# Altium schematic sheet Q12.SchDoc
size A3
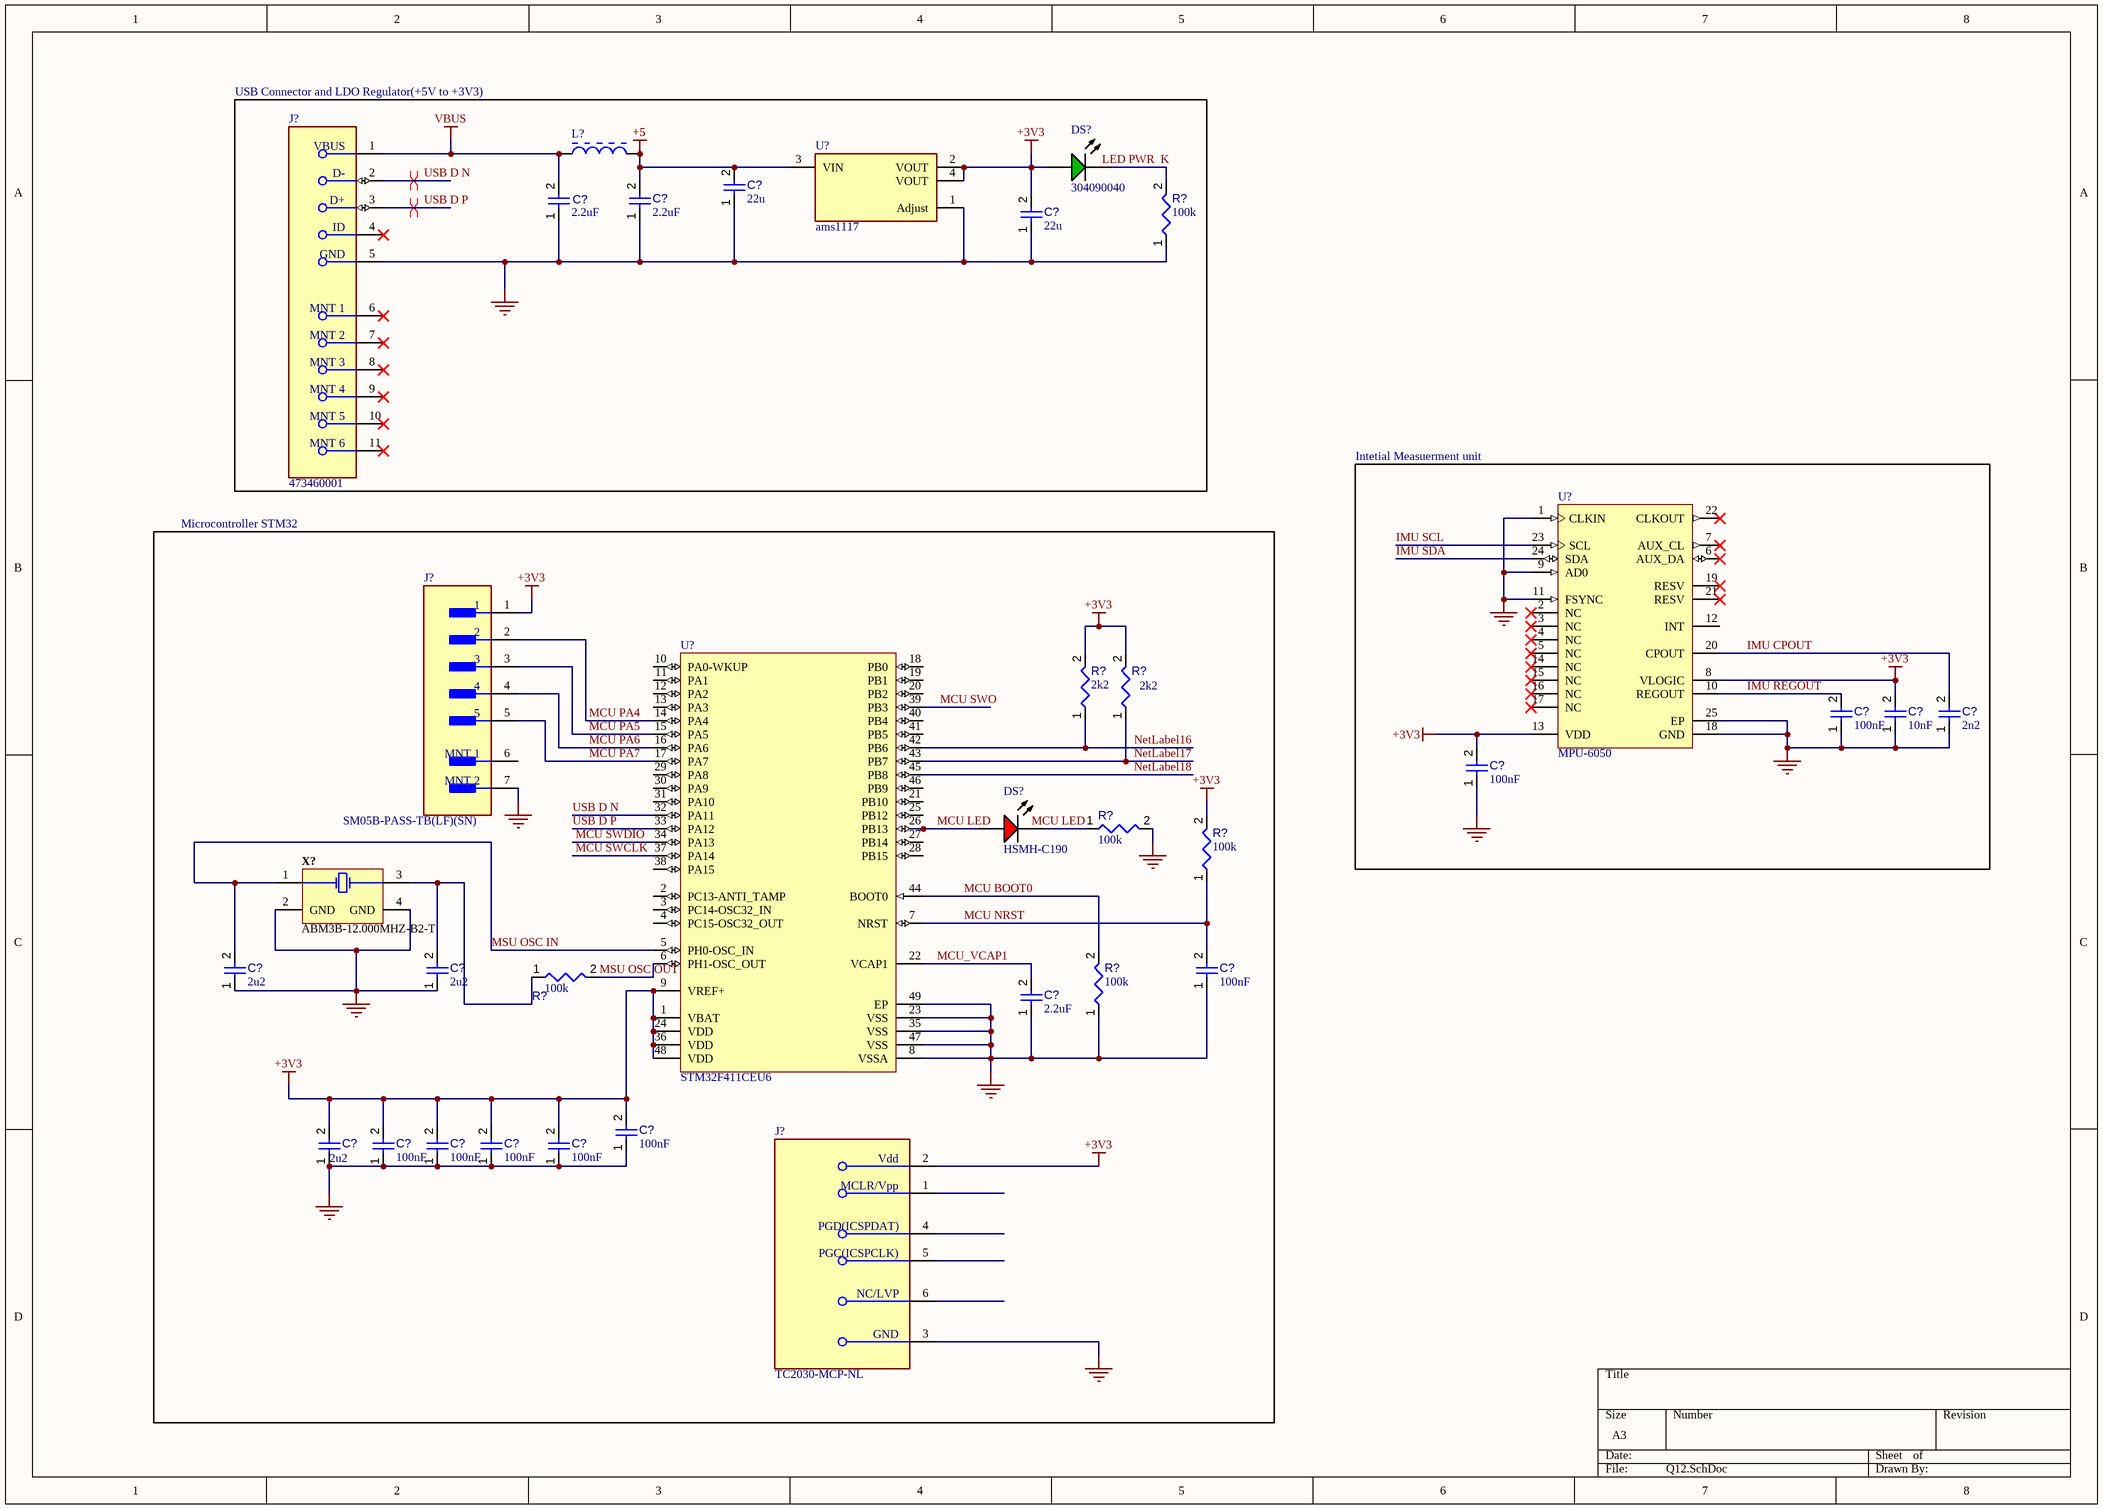
[diagram p0: Q12.SchDoc]

## Parts
(Parts that share a designator on the sheet are numbered #1, #2 ... from top to bottom, then left to right.)
C?#1  value 22u  [CAPC0805(2012)145_L]  (hidden comment: Capacitor 47µF +/-40% 6.3V 0805)
C?#2  value 2.2uF  [CAPC0603(1608)100_L]  (hidden comment: Capacitor 1µF +/-0.1% 25V 0603)
C?#3  value 2.2uF  [CAPC0603(1608)100_L]  (hidden comment: Capacitor 1µF +/-0.1% 25V 0603)
C?#4  value 22u  [CAPC0805(2012)145_L]  (hidden comment: Capacitor 47µF +/-40% 6.3V 0805)
C?#5  value 100nF  [CAPC0402(1005)60_L]  (hidden comment: Capacitor 100nF +/-20% 25V 0402)
C?#6  value 10nF  [CAPC0402(1005)60_L]  (hidden comment: Capacitor 100nF +/-20% 25V 0402)
C?#7  value 2n2  [CAPC0402(1005)60_L]  (hidden comment: Capacitor 100nF +/-20% 25V 0402)
C?#8  value 100nF  [CAPC0402(1005)60_L]  (hidden comment: Capacitor 100nF +/-20% 25V 0402)
C?#9  value 2u2  [CAPC0603(1608)100_L]  (hidden comment: Capacitor 1µF +/-0.1% 25V 0603)
C?#10  value 2u2  [CAPC0603(1608)100_L]  (hidden comment: Capacitor 1µF +/-0.1% 25V 0603)
C?#11  value 100nF  [CAPC0402(1005)60_L]  (hidden comment: Capacitor 100nF +/-20% 25V 0402)
C?#12  value 2.2uF  [CAPC0603(1608)100_L]  (hidden comment: Capacitor 1µF +/-0.1% 25V 0603)
C?#13  value 100nF  [CAPC0402(1005)60_L]  (hidden comment: Capacitor 100nF +/-20% 25V 0402)
C?#14  value 2u2  [CAPC0603(1608)100_L]  (hidden comment: Capacitor 1µF +/-0.1% 25V 0603)
C?#15  value 100nF  [CAPC0402(1005)60_L]  (hidden comment: Capacitor 100nF +/-20% 25V 0402)
C?#16  value 100nF  [CAPC0402(1005)60_L]  (hidden comment: Capacitor 100nF +/-20% 25V 0402)
C?#17  value 100nF  [CAPC0402(1005)60_L]  (hidden comment: Capacitor 100nF +/-20% 25V 0402)
C?#18  value 100nF  [CAPC0402(1005)60_L]  (hidden comment: Capacitor 100nF +/-20% 25V 0402)
DS?#1  304090040  [LED-2P-2.28-3MM]
DS?#2  HSMH-C190  [AVAG-HSMX-C190_V]
J?#1  473460001  [FP-473460001-MFG]
J?#2  SM05B-PASS-TB(LF)(SN)  [FP-SM05B-PASS-TB_LF_SN-MFG]
J?#3  TC2030-MCP-NL  [FP-TC2030-MCP-NL-MFG]
L?  BLM18AG121SN1D  [MURA-BLM18-F-H1-CHIP-2_V]  (value not drawn)
R?#1  value 100k  [RESC0402(1005)_L]  (hidden comment: 100KR2F)
R?#2  value 2k2  [RESC0402(1005)_L]  (hidden comment: 100KR2F)
R?#3  value 2k2  [RESC0402(1005)_L]  (hidden comment: 100KR2F)
R?#4  value 100k  [RESC0402(1005)_L]  (hidden comment: 100KR2F)
R?#5  value 100k  [RESC0402(1005)_L]  (hidden comment: 100KR2F)
R?#6  value 100k  [RESC0402(1005)_L]  (hidden comment: 100KR2F)
R?#7  value 100k  [RESC0402(1005)_L]  (hidden comment: 100KR2F)
U?#1  ams1117  [FP-ams1117-IPC_C]
U?#2  MPU-6050  [IS-QFN-24_V]
U?#3  STM32F411CEU6  [STM-UFQFPN48_L]
X?  ABM3B-12.000MHZ-B2-T  [ABRA-ABM3B-4_V]

## Blocks framed on the sheet
USB Connector and LDO Regulator(+5V to +3V3): C?#1-C?#4 DS?#1 J?#1 L? R?#1 U?#1
Intetial Measuerment unit: C?#5-C?#8 U?#2
Microcontroller STM32: C?#9-C?#18 DS?#2 J?#2 J?#3 R?#2-R?#7 U?#3 X?

## Nets
+3V3: C?#4.2 C?#6.2 C?#8.2 C?#13.2 C?#14.2 C?#15.2 C?#16.2 C?#17.2 C?#18.2 DS?#1.1(A) J?#2.1 J?#3.2(Vdd) R?#2.2 R?#3.2 R?#5.2 U?#1.2(VOUT) U?#1.4(VOUT) U?#2.8(VLOGIC) U?#2.13(VDD) U?#3.1(VBAT) U?#3.9(VREF+) U?#3.24(VDD) U?#3.36(VDD) U?#3.48(VDD)
+5: C?#1.2 C?#3.2 L?.2 U?#1.3(VIN)
GND: C?#1.1 C?#2.1 C?#3.1 C?#4.1 C?#5.1 C?#6.1 C?#7.1 C?#8.1 C?#9.1 C?#10.1 C?#11.1 C?#12.1 C?#13.1 C?#14.1 C?#15.1 C?#16.1 C?#17.1 C?#18.1 J?#1.5(GND) J?#2.7(MNT_2) J?#3.3(GND) R?#1.1 R?#4.2 R?#7.1 U?#1.1(Adjust) U?#2.1(CLKIN) U?#2.9(AD0) U?#2.11(FSYNC) U?#2.18(GND) U?#2.25(EP) U?#3.8(VSSA) U?#3.23(VSS) U?#3.35(VSS) U?#3.47(VSS) U?#3.49(EP) X?.2(GND) X?.4(GND)
VBUS: C?#2.2 J?#1.1(VBUS) L?.1
 MCU PA4: J?#2.2 U?#3.14(PA4)
 MCU PA5: J?#2.3 U?#3.15(PA5)
 MCU PA6: J?#2.4 U?#3.16(PA6)
 MCU PA7: J?#2.5 U?#3.17(PA7)
 MCU SWCLK: U?#3.37(PA14)
 MCU SWDIO: U?#3.34(PA13)
 MCU SWO: U?#3.39(PB3)
IMU CPOUT: C?#7.2 U?#2.20(CPOUT)
IMU REGOUT: C?#5.2 U?#2.10(REGOUT)
IMU SCL: U?#2.23(SCL)
IMU SDA: U?#2.24(SDA)
MCU BOOT0: R?#7.2 U?#3.44(BOOT0)
MCU LED: DS?#2.1(A) U?#3.26(PB13)
MCU NRST: C?#11.2 R?#5.1 U?#3.7(NRST)
MCU_VCAP1: C?#12.2 U?#3.22(VCAP1)
MSU OSC IN: C?#9.2 U?#3.5(PH0-OSC_IN) X?.1(X1)
MSU OSC OUT: R?#6.2 U?#3.6(PH1-OSC_OUT)
NetLabel16: R?#2.1 U?#3.42(PB6)
NetLabel17: R?#3.1 U?#3.43(PB7)
NetLabel18: U?#3.45(PB8)
USB D N: J?#1.2(D-) U?#3.32(PA11)
USB D P: J?#1.3(D+) U?#3.33(PA12)
NetC?#10_2: C?#10.2 R?#6.1 X?.3(X2)
NetDS?#1_2: DS?#1.2(K) R?#1.2
NetDS?#2_2: DS?#2.2(K) R?#4.1

Not connected (* = marked no-connect by the designer): J?#1 4(ID)* 6(MNT_1)* 7(MNT_2)* 8(MNT_3)* 9(MNT_4)* 10(MNT_5)* 11(MNT_6)*; J?#2 6(MNT_1); J?#3 1(MCLR/Vpp) 4(PGD(ICSPDAT)) 5(PGC(ICSPCLK)) 6(NC/LVP); U?#2 2(NC)* 3(NC)* 4(NC)* 5(NC)* 6(AUX_DA)* 7(AUX_CL)* 12(INT) 14(NC)* 15(NC)* 16(NC)* 17(NC)* 19(RESV)* 21(RESV)* 22(CLKOUT)*; U?#3 2(PC13-ANTI_TAMP) 3(PC14-OSC32_IN) 4(PC15-OSC32_OUT) 10(PA0-WKUP) 11(PA1) 12(PA2) 13(PA3) 18(PB0) 19(PB1) 20(PB2) 21(PB10) 25(PB12) 27(PB14) 28(PB15) 29(PA8) 30(PA9) 31(PA10) 38(PA15) 40(PB4) 41(PB5) 46(PB9)

## Layout directives
differential pair: USB D N, USB D P

## Notes on the sheet
- Labels drawn without touching a wire or pin:  LED PWR  K, MCU LED

## Library data of the parts
C?#1 C?#4 = CMP-001-00082-4: Chip Capacitor, 47µF +/-40%, 6.3V, 0805, Thickness 1.45 mm; Tolerance: 10%; Min Operating Temperature: -55°C; Max Operating Temperature: 85°C; Case/Package: 0805; Pins: 2; Mounting Technology: SMT; Voltage Rating: 6.3V
C?#2 C?#3 C?#9 C?#10 C?#12 C?#14 = CMP-001-00055-4: Chip Capacitor, 2.2uF +/-0.1%, 25V, 0603, Thickness 1 mm; Tolerance: 20%; Min Operating Temperature: -55°C; Max Operating Temperature: 85°C; Voltage Rating: 25V; Mounting Technology: SMT; Case/Package: 0603; Pins: 2
C?#5-C?#8 C?#11 C?#13 C?#15-C?#18 = CMP-001-00065-4: Chip Capacitor, 100nF +/-20%, 25V, 0402, Thickness 0.6 mm; Tolerance: 10%; Max Operating Temperature: 85°C; Min Operating Temperature: -55°C; Pins: 2; Voltage Rating: 25V; Mounting Technology: SMT; Case/Package: 0402
DS?#1 = CMP-007-00006-2: Green LED, 80 mW, 20 mA, -25 to 85 degC, 2-Pin THD; Manufacturer: Shenzhen CGX; Manufacturer URL: http://szcgx.com/; Package Reference: 304090040; Datasheet Version: Rev. 1.0, 09/2014; RoHS Compliant: Unknown; Case/Package: 304090040; Package Description: 2-Pin Through Hole Device, Dia 3 mm, Pitch 2.28 mm; Datasheet URL: http://datasheet.octopart.com/304090040-Chengguangxing-datasheet-62330655.pdf; Mounting Technology: TH
DS?#2 = CMP-007-00014-2: LED Uni-Color Red, 65 mW, 20 mA, -40 to 85 degC, 2-Pin SMD, RoHS, Tape and Reel; Manufacturer: Avago; Nominal Vf: 1.8V; Luminous Intensity: 17mcd; Power: 78mW; Forward Current: 20mA; Lens Style: Diffused; Viewing Angle: 170degrees; Package Quantity: 4000; Colour: Red; Manufacturer URL: http://www.avagotech.com/; Min Operating Temperature: -40°C; Datasheet URL: http://docs.avagotech.com/docs/AV02-0551EN; RoHS Compliant: True; Forward Voltage: 1.8V; Pins: 2; Max Operating Temperature: 85°C; Packaging: TapeandReel; Package Reference: HSMX-C190; Datasheet Version: Mar-12; Package Description: 2-Pin Surface Mount Device, Body 1.6 x 0.8 mm, Height 0.9 mm; Case/Package: 0603; Mounting Technology: SM; Illumination Colour: Red
J?#1 = CMP-2000-05246-2: CONN RCPT USB2.0 MICRO B SMD R/A; Manufacturer: Molex; Conn Orientation: Right Angle; Is Female: yes; Shielding: true; Pitch: 0.65mm; Number Of Contacts: 5; Description: USB - micro B USB 2.0 Receptacle Connector 5 Position Surface Mount, Right Angle; Voltage Rating: 30V; Current Rating: 1.8A; Device Class L2: USB Connectors; Digikey Description: CONN RCPT USB2.0 MICRO B SMD R/A; Height: 2.945mm; RoHS: TRUE; ComponentLink2Description: Datasheet; Octopart: https://octopart.com/47346-0001-molex-7164928; Automotive: No; Package: 0; Category: Conn; Device Class L1: Connectors; Usb Standard: USB 2.0; Temperature: -30°C to +85°C; Temperature Range Low: -30°C; Footprint Url: https://www.molex.com/pdm_docs/sd/473460001_sd.pdf; ComponentLink2URL: https://www.molex.com/webdocs/datasheets/pdf/en-us/0473460001_IO_CONNECTORS.pdf; Lead Free: Yes; Manufacturer Part Number: 473460001; Contact Material: Gold,Nickel; Temperature Range High: +85°C; Device Class L3: unset
J?#2 = CMP-17439-000533-1: Wire-To-Board Connector, Pa Series, Surface Mount, Header, 5, 2 Mm, Tin Plated Contacts Rohs Compliant: Yes; Number of Positions: 5; Gender: Male; Pitch: 2mm; Termination: Crimp; Contact Plating: Tin; Number of Contacts: 5; Number of Rows: 1; Mount: Surface Mount; Packaging: Cut Tape; Reach SVHC Compliant: Yes; Contact Material: Copper; Color: Beige; Lead Free: Lead Free
J?#3 = CMP-205963-000002-1: CABLE TAG-CONNECT IN-CIRCUIT; RoHS Compliant: Yes; Series: -; Reach SVHC Compliant: Yes; Package Quantity: 1; Lead Free: Lead Free
L? = CMP-006-00004-3: Chip Ferrite Bead for General Use, 120 Ohm, 500 mA, -55 to 125 degC, 0603 (1608 Metric), RoHS, Tape and Reel; Manufacturer: Murata; Max Current Rating: 500mA; Tolerance: 25%; Impedance: 120Ohm; Resistance: 200mohm; Min Operating Temperature: -55°C; Package Reference: BLM18_H950-2; Max Operating Temperature: 125°C; Current Rating: 500mA; Core Material: Ferrite; Datasheet Version: Jun-12; Packaging: TapeandReel; Datasheet URL: https://statics3.seeedstudio.com/images/opl/datasheet/303010016.pdf; Package Quantity: 4000; Case/Package: 0603; RoHS Compliant: True
R?#1-R?#7 = CMP-009-00064-2: 100K 0.063W 1% 0402 (1005 Metric)  SMD; Power: 63mW; Case/Package: 0402; Mounting Technology: SMT; Pins: 2; Tolerance: 1%
U?#1 = CMP-209535-000002-1: 1A LOW DROPOUT VOLTAGE REGULATOR; RoHS Compliant: Yes
U?#2 = CMP-1753-00002-2: 3-Axis Gyroscope, Accelerometer and a Digital Motion Processor(TM) (DMP), 2.375 to 3.46 V, -40 to 85 degC, 24-Pin QFN, RoHS, Tape and Reel; Manufacturer: InvenSense; Featured Product: MPU-60506-Axis,IntegratedI²CSolution; Other Names: 1428-1007-2 / MPU6050; Sensor Type: MotionTracking; Online Catalog: MPU-6000™Series; Unit PriceUSD: Digital; Datasheet Version: Rev. 3.3, 05/2012; Category: Sensors,Transducers; Datasheet URL: http://datasheet.octopart.com/MPU-6050-InvenSense-datasheet-14421344.pdf; Family: Multifunction; Standard Package: 5,000; Manufacturer URL: http://www.invensense.com/; Output Type: Digital; Dynamic Catalog: MPU-6000™Series
U?#3 = CMP-0243-00165-1: ARM Cortex-M4 32-bit MCU+FPU, 512 KB Flash, 128 KB RAM, 36 I/Os, 48-Pin UFQFPN, -40 to 85 degC, Tray; Operating Frequency(F) (Processor speed) (MHz): 100; FLASH Size (Prog) (kB): 512; Internal RAM Size (kB): 128; I/Os (High Current): 36; Supply Voltage(Vcc) min (V): 1.7; Package Reference: 48-Pin Ultra Thin Fine Pitch Quad Flat No-Lead, 7 x 7 x 0.6 mm Body, 0.5 mm Pitch, Exposed Pad; ComponentLink1Description: Manufacturer URL; ComponentLink1URL: http://www.st.com/; Packing: Tray; Package Description: UFQFPN48; Core: ARM Cortex-M4; ComponentLink2Description: Datasheet; ComponentLink2URL: http://www.st.com/st-web-ui/static/active/en/resource/technical/document/datasheet/DM00115249.pdf; DatasheetVersion: Rev. 6; Mounting Technology: Surface Mount
X? = CMP-003-00015-2: Ceramic SMD Crystal, 12 MHz, +/- 20 ppm, 18 pF, -20 to 70 degC, 4-Pin SMD, RoHS, Tape and Reel; Manufacturer: Abracon; ESR: 70; Load Capacitance: 18pF; Tolerance: 20ppm; Frequency: 12MHz; Resistance: 70Ohm; Mounting Technology: SM; Packaging: TapeandReel; Datasheet URL: http://www.abracon.com/Resonators/abm3b.pdf; Manufacturer URL: http://www.abracon.com/; RoHS Compliant: True; Frequency Tolerance: 20ppm; Datasheet Version: Aug-15; Max Operating Temperature: 70°C; Package Reference: ABM3B; Min Operating Temperature: -20°C; Pins: 4; Package Quantity: 1000; Package Description: 4-Pin Surface Mount Device, Body 5 x 3.2 mm; Case/Package: CSMD